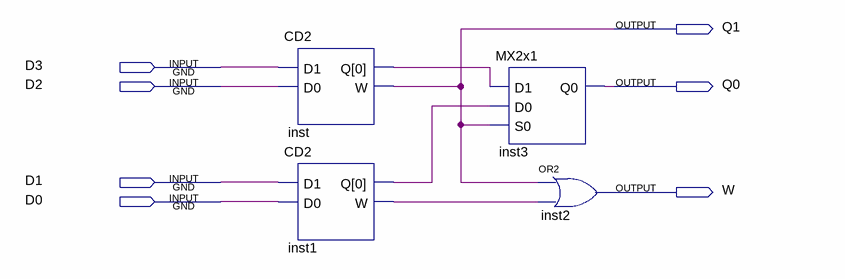
[diagram p0: schematic sheet]
// Quartus schematic CD4.bdf as structural Verilog: 4 symbols, 7 pins
module CD4 (
  input  D3,
  input  D2,
  input  D1,
  input  D0,
  output Q1,
  output Q0,
  output W
);

  wire inst1_q, inst1_w, inst_q;

  CD2 inst (.D1(D3), .D0(D2), .Q(inst_q), .W(Q1));
  CD2 inst1 (.D1(D1), .D0(D0), .Q(inst1_q), .W(inst1_w));
  MX2x1 inst3 (.D1(inst_q), .D0(inst1_q), .S0(Q1), .Q0(Q0));
  or inst2 (W, Q1, inst1_w);
endmodule
